# EasyEDA Pro project BLDCV6-nerdyintern.eprj, schematic Schematic1_1
Create Date: 2024-09-27; Page Name: P1; Project Name: BLDCV6; Schematic Name: Schematic1_1; Update Date: 2024-09-27; Company: EasyEDA.com; Drawn: EasyEDA; Page Size: A4; Part Number: JLCPCB-002; Reviewed: EasyEDA; Version: V0.1
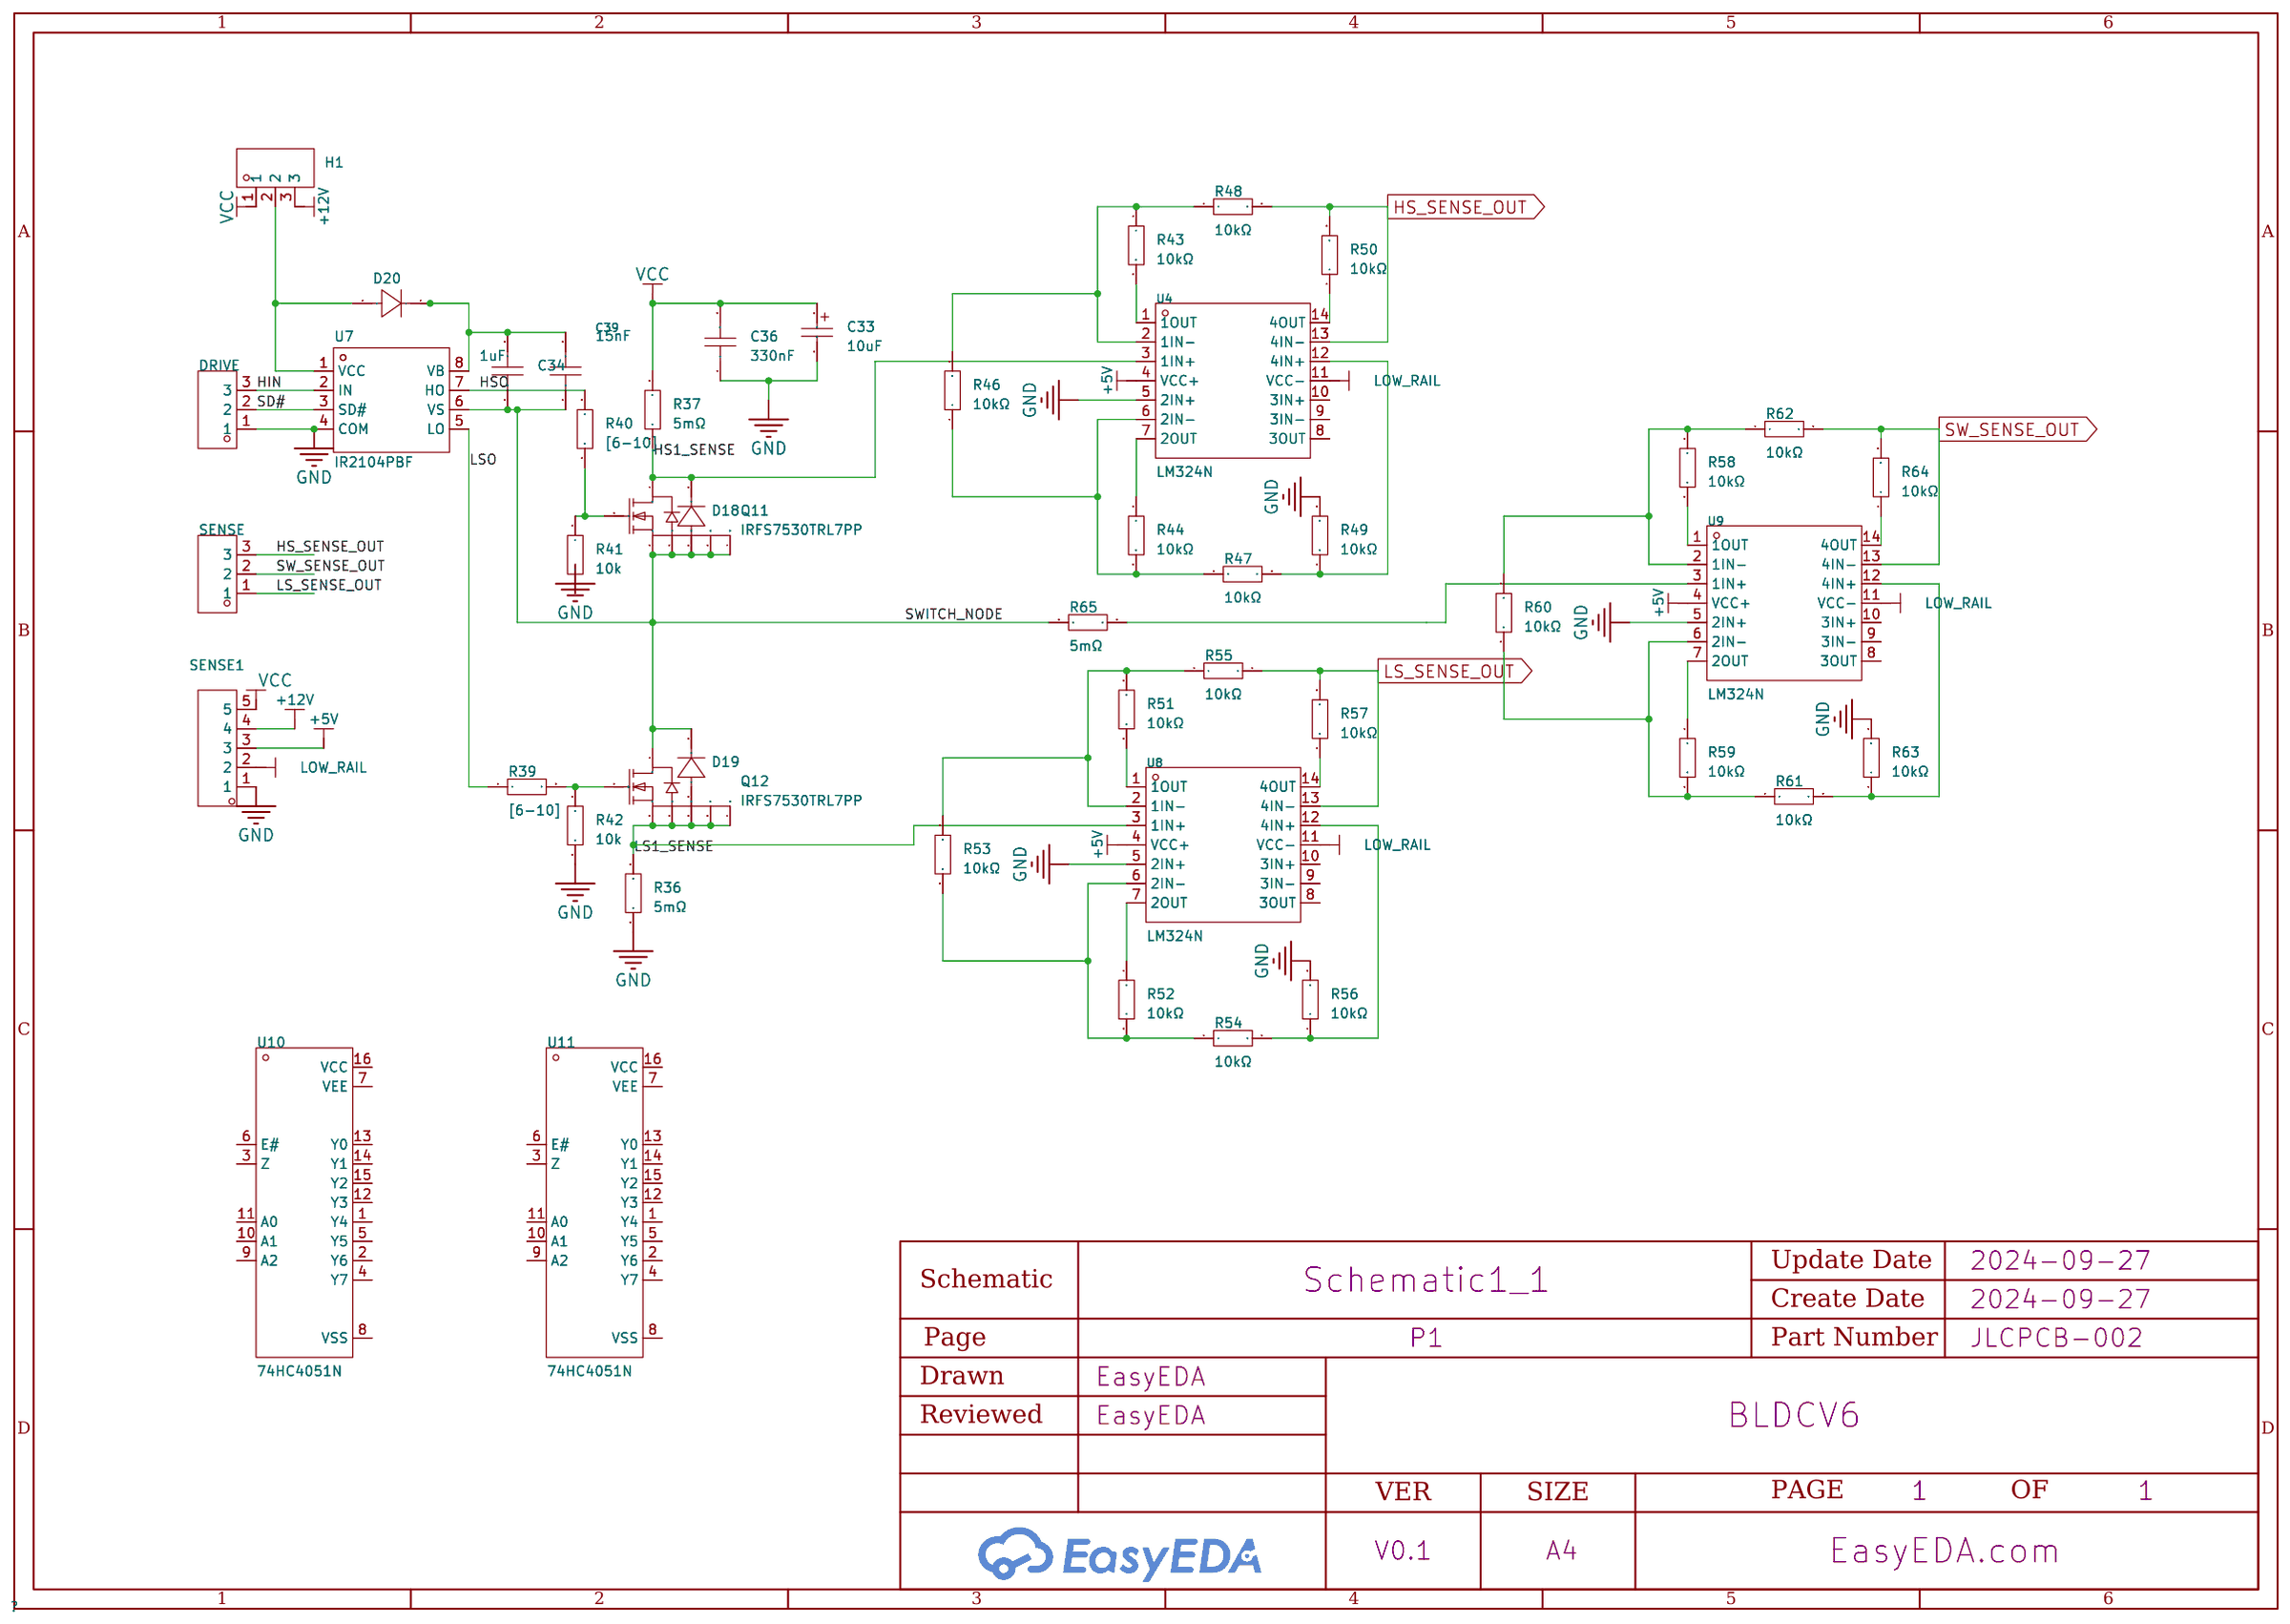
[diagram p4: schematic sheet]

## Parts
C33  10uF  [CAP-SMD_BD5.0-L5.3-W5.3-LS6.3-FD]
C34  1uF  [CAP-TH_L7.2-W2.5-P5.00-D0.6]
C36  330nF  [CAP-TH_L18.0-W7.5-P15.00-D0.8]
C39  15nF  [CAP-TH_L13.5-W5.5-P10.50-D1.2]
D18  -  [DO-41_BD2.4-L4.7-P8.70-D0.9-RD]
D19  -  [DO-41_BD2.4-L4.7-P8.70-D0.9-RD]
D20  -  [DO-41_BD2.4-L4.7-P8.70-D0.9-RD]
DRIVE  -  [HDR-TH_3P-P2.54-V-M]
H1  -  [HDR-TH_3P-P2.54-V-M]
Q11  IRFS7530TRL7PP  [D2PAK-7_L10.6-W9.6-P1.27-LS15.9-BR]
Q12  IRFS7530TRL7PP  [D2PAK-7_L10.6-W9.6-P1.27-LS15.9-BR]
R36  5mΩ  [R2512]
R37  5mΩ  [R2512]
R39  [6-10]  [RES-TH_BD3.3-L9.0-P13.00-D0.6]
R40  [6-10]  [RES-TH_BD3.3-L9.0-P13.00-D0.6]
R41  10k  [RES-TH_BD3.3-L9.0-P13.00-D0.6]
R42  10k  [RES-TH_BD3.3-L9.0-P13.00-D0.6]
R43  10kΩ  [R_AXIAL-0.4]
R44  10kΩ  [R_AXIAL-0.4]
R46  10kΩ  [R_AXIAL-0.4]
R47  10kΩ  [R_AXIAL-0.4]
R48  10kΩ  [R_AXIAL-0.4]
R49  10kΩ  [R_AXIAL-0.4]
R50  10kΩ  [R_AXIAL-0.4]
R51  10kΩ  [R_AXIAL-0.4]
R52  10kΩ  [R_AXIAL-0.4]
R53  10kΩ  [R_AXIAL-0.4]
R54  10kΩ  [R_AXIAL-0.4]
R55  10kΩ  [R_AXIAL-0.4]
R56  10kΩ  [R_AXIAL-0.4]
R57  10kΩ  [R_AXIAL-0.4]
R58  10kΩ  [R_AXIAL-0.4]
R59  10kΩ  [R_AXIAL-0.4]
R60  10kΩ  [R_AXIAL-0.4]
R61  10kΩ  [R_AXIAL-0.4]
R62  10kΩ  [R_AXIAL-0.4]
R63  10kΩ  [R_AXIAL-0.4]
R64  10kΩ  [R_AXIAL-0.4]
R65  5mΩ  [R2512]
SENSE  -  [HDR-TH_3P-P2.54-V-M]
SENSE1  -  [HDR-TH_5P-P2.54-V-M]
U4  LM324N  [DIP-14_L19.3-W7.0-P2.54-LS7.6-BL]
U7  IR2104PBF  [DIP-8_L9.9-W6.6-P2.54-LS7.62-BL]
U8  LM324N  [DIP-14_L19.3-W7.0-P2.54-LS7.6-BL]
U9  LM324N  [DIP-14_L19.3-W7.0-P2.54-LS7.6-BL]
U10  74HC4051N  [PDIP-16_L19.3-W6.4-P2.54-LS7.94-BL]
U11  74HC4051N  [PDIP-16_L19.3-W6.4-P2.54-LS7.94-BL]

## Library data of the parts
C33 = C_Ele_SMD_5x5.4mm: Supplier Footprint: SMD,5x5.4mm
C34 = SMEC334J100M2: Capacitance: Tolerance:±5% Tolerance:±5% Voltage Rated:; LCSC Part Name: 330nF ±5% 100V; Supplier Part: C401104; Manufacturer: CHAMPION(全鹏); Supplier Footprint: 插件,P=5mm; JLCPCB Part Class: Extended Part; Datasheet: https://atta.szlcsc.com/upload/public/pdf/source/20190730/C401104_3330673C3D333BC9993FC47731C2A492.pdf; Supplier: LCSC; Tolerance: ±5%
C36 = 1DH433D400-04: Capacitance: Tolerance:±5% Tolerance:±5% Voltage Rated:; LCSC Part Name: 330nF ±5% 400V; Supplier Part: C2846751; Manufacturer: BM(丰明电容); Supplier Footprint: 插件,P=15mm; JLCPCB Part Class: Extended Part; Datasheet: https://atta.szlcsc.com/upload/public/pdf/source/20210820/3239ADB888E618FC58D2408F4FC96F9F.pdf; Supplier: LCSC; Tolerance: ±5%
C39 = FGSM(161) 400VDC 153J 1A1: Capacitance: Tolerance:±5% Tolerance:±5% Voltage Rated: Operating Temperature:-40℃~+105℃ Operating Temperature:-40℃~+105℃; LCSC Part Name: 15nF ±5% 400V; Supplier Part: C185968; Manufacturer: SHINYEI(神荣); Supplier Footprint: 插件; JLCPCB Part Class: Extended Part; Supplier: LCSC; Tolerance: ±5%; Operating Temperature: -40℃~+105℃
D18-D20 = 1N4007: Supplier Footprint: DO-41
DRIVE H1 SENSE = HDR-M_2.54_1x3P: Supplier Footprint: Through
Q11 Q12 = IRFS7530TRL7PP: Type:1个NChannel Drain Source Voltage (Vdss): Continuous Drain Current (Id): Power Dissipation (Pd): Drain Source On Resistance (RDS(on)@Vgs,Id):1.4mΩ@10V,100A Gate Threshold Voltage (Vgs(th)@Id):3.7V@250uA Total Gate Charge (Qg@Vgs):354nC@10V Input Capaci; LCSC Part Name: 1个N沟道 耐压:60V 电流:240A; Supplier Part: C445669; Manufacturer: Infineon(英飞凌); Supplier Footprint: TO-263-7; JLCPCB Part Class: Extended Part; Datasheet: https://atta.szlcsc.com/upload/public/pdf/source/20200320/C445669_7E95350FFD1C4CDB697958F0143FEA0B.pdf; Supplier: LCSC; Type: 1个NChannel; Drain Source On Resistance (RDS(on)@Vgs,Id): 1.4mΩ@10V,100A; Gate Threshold Voltage (Vgs(th)@Id): 3.7V@250uA; Total Gate Charge (Qg@Vgs): 354nC@10V; Input Capacitance (Ciss@Vds): 12.96nF@25V; Operating Temperature: -55℃~+175℃@(Tj)
R36 R37 R65 = PA2512FKF7W0R005E: Type:Current Sensing Resistors Resistance: Tolerance:±1% Tolerance:±1% Power(Watts): Temperature Coefficient:±100ppm/℃ Temperature Coefficient:±100ppm/℃; LCSC Part Name: 5mΩ ±1% 2W; Supplier Part: C309526; Manufacturer: YAGEO(国巨); Supplier Footprint: 2512; JLCPCB Part Class: Extended Part; Datasheet: https://atta.szlcsc.com/upload/public/pdf/source/20190227/C375693_219964CC8B3EBD36DBDF701587FA5938.pdf; Supplier: LCSC; Type: Current Sensing Resistors; Tolerance: ±1%; Temperature Coefficient: ±100ppm/℃
R39-R42 = Res_AXIAL-1/2W: Supplier Footprint: Through
R43 R44 R46-R64 = Res_AXIAL-1/4W: Supplier Footprint: Through
SENSE1 = HDR-M_2.54_1x5P: Supplier Footprint: Through
U4 U8 U9 = LM324N_C114380: Number of Circuits:Quad Gain Bandwidth Product(GBP):1.2MHz Current - Input Bias(Ib):45nA Slew Rate(SR):- Output Current:40mA -3db Bandwidth:- Supply Current:1mA Operating Temperature:0℃~+70℃ Operating Temperature:0℃~+70℃; Supplier Part: C114380; Manufacturer: TI(德州仪器); Supplier Footprint: DIP-14; JLCPCB Part Class: Extended Part; Datasheet: https://www.ti.com/cn/lit/gpn/lm324; Supplier: LCSC; Number of Circuits: Quad; Gain Bandwidth Product(GBP): 1.2MHz; Current - Input Bias(Ib): 45nA; Output Current: 40mA; Supply Current: 1mA; Operating Temperature: 0℃~+70℃
U7 = IR2104PBF: Driven Configuration:Half Bridge Load Type:MOSFET；IGBT Number of Drivers:2 Peak Output Current(sink):360mA Peak Output Current(source):210mA Supply Voltage:10V~20V Supply Voltage:10V~20V Rise Time:100ns Fall Time:50ns Operating Temperature:-40℃~+150℃@(Tj); LCSC Part Name: IR2104PBF 停产; Supplier Part: C2959; Manufacturer: Infineon(英飞凌); Supplier Footprint: PDIP-8; JLCPCB Part Class: Extended Part; Datasheet: https://atta.szlcsc.com/upload/public/pdf/source/20140906/1457707236579.pdf; Supplier: LCSC; Driven Configuration: Half Bridge; Load Type: MOSFET；IGBT; Number of Drivers: 2; Peak Output Current(sink): 360mA; Peak Output Current(source): 210mA; Supply Voltage: 10V~20V; Rise Time: 100ns; Fall Time: 50ns; Operating Temperature: -40℃~+150℃@(Tj)
U10 U11 = 74HC4051N: Supplier Part: C22461600; Manufacturer: HGSEMI(华冠); Supplier Footprint: DIP-16; JLCPCB Part Class: Extended Part; Datasheet: https://atta.szlcsc.com/upload/public/pdf/source/20240606/3124DD8C3BD226D04519A3C9F1D82978.pdf; Supplier: LCSC

## Nets
+5V: SENSE1.3 U4.4(VCC+) U8.4(VCC+) U9.4(VCC+)
+12V: H1.3 SENSE1.4
GND: C33.2 C36.1 DRIVE.1 R36.1 R41.2 R42.2 R49.2 R56.2 R63.2 SENSE1.1 U4.5(2IN+) U7.4(COM) U8.5(2IN+) U9.5(2IN+)
VCC: C33.1 C36.2 H1.1 R37.2 SENSE1.5
HIN: DRIVE.3 U7.2(IN)
HS1_SENSE: D18.1(K) Q11.4(D) R37.1 U4.3(1IN+)
HS_SENSE_OUT: R48.2 R50.2 SENSE.3 U4.13(4IN-)
HSO: R40.2 U7.7(HO)
LOW_RAIL: SENSE1.2 U4.11(VCC-) U8.11(VCC-) U9.11(VCC-)
LS1_SENSE: D19.2(A) Q12.2(S) Q12.3(S) Q12.5(S) Q12.6(S) Q12.7(S) R36.2 U8.3(1IN+)
LS_SENSE_OUT: R55.2 R57.2 SENSE.1 U8.13(4IN-)
LSO: R39.1 U7.5(LO)
SD#: DRIVE.2 U7.3(SD#)
SW_SENSE_OUT: R62.2 R64.2 SENSE.2 U9.13(4IN-)
SWITCH_NODE: C34.1 C39.1 D18.2(A) D19.1(K) Q11.2(S) Q11.3(S) Q11.5(S) Q11.6(S) Q11.7(S) Q12.4(D) R65.2 U7.6(VS)
$1N6799: C34.2 C39.2 D20.1(K) U7.8(VB)
$1N6814: Q12.1(G) R39.2 R42.1
$1N6817: Q11.1(G) R40.1 R41.1
$1N9323: R43.2 U4.1(1OUT)
$1N9349: R44.1 U4.7(2OUT)
$1N9578: R44.2 R46.1 R47.1 U4.6(2IN-)
$1N9592: R43.1 R46.2 R48.1 U4.2(1IN-)
$1N9659: R47.2 R49.1 U4.12(4IN+)
$1N9763: R50.1 U4.14(4OUT)
$1N10683: R51.2 U8.1(1OUT)
$1N10684: R52.1 U8.7(2OUT)
$1N10685: R52.2 R53.1 R54.1 U8.6(2IN-)
$1N10686: R51.1 R53.2 R55.1 U8.2(1IN-)
$1N10689: R54.2 R56.1 U8.12(4IN+)
$1N10691: R57.1 U8.14(4OUT)
$1N10984: R58.2 U9.1(1OUT)
$1N10985: R59.1 U9.7(2OUT)
$1N10986: R59.2 R60.1 R61.1 U9.6(2IN-)
$1N10987: R58.1 R60.2 R62.1 U9.2(1IN-)
$1N10990: R61.2 R63.1 U9.12(4IN+)
$1N10992: R64.1 U9.14(4OUT)
$1N11070: R65.1 U9.3(1IN+)
$1N12635: D20.2(A) H1.2 U7.1(VCC)

Not connected (* = marked no-connect by the designer): U4 8(3OUT) 9(3IN-) 10(3IN+); U8 8(3OUT) 9(3IN-) 10(3IN+); U9 8(3OUT) 9(3IN-) 10(3IN+); U10 1(Y4) 2(Y6) 3(Z) 4(Y7) 5(Y5) 6(E#) 7(VEE) 8(VSS) 9(A2) 10(A1) 11(A0) 12(Y3) 13(Y0) 14(Y1) 15(Y2) 16(VCC); U11 1(Y4) 2(Y6) 3(Z) 4(Y7) 5(Y5) 6(E#) 7(VEE) 8(VSS) 9(A2) 10(A1) 11(A0) 12(Y3) 13(Y0) 14(Y1) 15(Y2) 16(VCC)
